# EAGLE design Shutter Sensors Old (EAGLE 9.0.1)
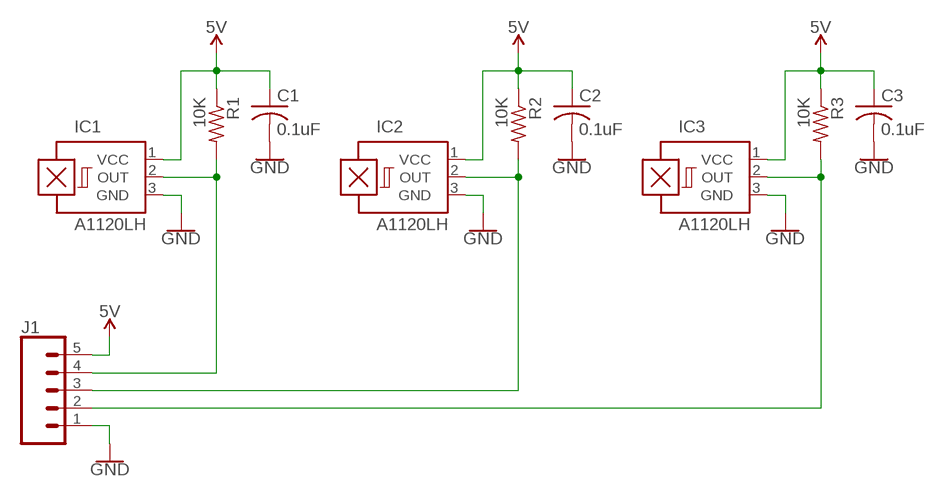
[diagram p0: schematic, sheet 1]

## Parts
C1  0.1uF  C-USC0805  [C0805]
C2  0.1uF  C-USC0805  [C0805]
C3  0.1uF  C-USC0805  [C0805]
IC1  A1120LH  A1203LH  [SOT23-W]
IC2  A1120LH  A1203LH  [SOT23-W]
IC3  A1120LH  A1203LH  [SOT23-W]
J1  CONN_05  [1X05]
R1  10K  R-US_R0805  [R0805]
R2  10K  R-US_R0805  [R0805]
R3  10K  R-US_R0805  [R0805]

## Nets
5V: C1.1 C2.1 C3.1 IC1.1(VCC) IC2.1(VCC) IC3.1(VCC) J1.5 R1.1 R2.1 R3.1
GND: C1.2 C2.2 C3.2 IC1.3(GND) IC2.3(GND) IC3.3(GND) J1.1
N$1: IC1.2(OUT) J1.4 R1.2
N$2: IC3.2(OUT) J1.2 R3.2
N$6: IC2.2(OUT) J1.3 R2.2

## Library data of the parts
C1-C3 = rcl:C-US: CAPACITOR, American symbol; SPICEPREFIX: C
IC1-IC3 = allegro:A12*?: Hall-effect bipolar switch Source: http://www.allegromicro.com/en/Products/Part_Numbers/1202/1202.pdf; MF: ALLEGRO MICROSYSTEMS, INC.; MPN: A1203LLHLT-T; OC_FARNELL: 1791384; OC_NEWARK: 31K6608
J1 = SparkFun-Connectors:CONN_05: Multi connection point. Often used as Generic Header-pin footprint for 0.1 inch spaced/style header connections On any of the 0.1 inch spaced packages, you can populate with these: Break Away Headers - Straight <https://www.sparkfun.com/products/116> (PRT-00116) Break Away Male Headers - Right Angle <https://www.sparkfun.com/products/553> (PRT-00553) Female Headers <https://www.sparkfun.com/products/115> (PRT-00115) Break Away Headers - Machine Pin <https://www.sparkfun.com/products/117> (PRT-00117) Break Away Female Headers - Swiss Machine Pin <https://www.sparkfun.com/products/743> (PRT-00743) For SCREWTERMINALS and SPRING TERMINALS visit here: Screw Terimnals on SparkFun.com <https://www.sparkfun.com/search/results?term=Screw+Terminals> (5mm/3.5mm/2.54mm spacing) This device is also useful as a general connection point to wire up your design to another part of your project. Our various solder wires solder well into these plated through hole pads. Hook-Up Wire - Assortment (Stranded, 22 AWG) <https://www.sparkfun.com/products/11375> (PRT-11375) Hook-Up Wire - Assortment (Solid Core, 22 AWG) <https://www.sparkfun.com/products/11367> (PRT-11367) View the entire wire category on our website here <https://www.sparkfun.com/categories/141> Special notes: Molex polarized connector foot print use with SKU : PRT-08231 with associated crimp pins and housings. 1MM SMD Version SKU: PRT-10208
R1-R3 = rcl:R-US_: RESISTOR, American symbol; SPICEPREFIX: R

## Board
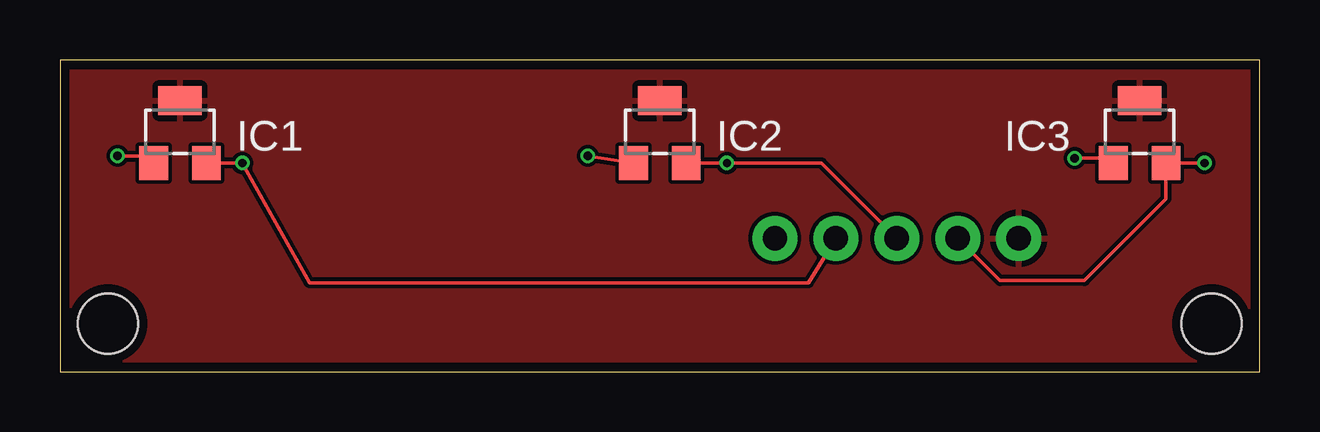
[diagram p1: board, top side]
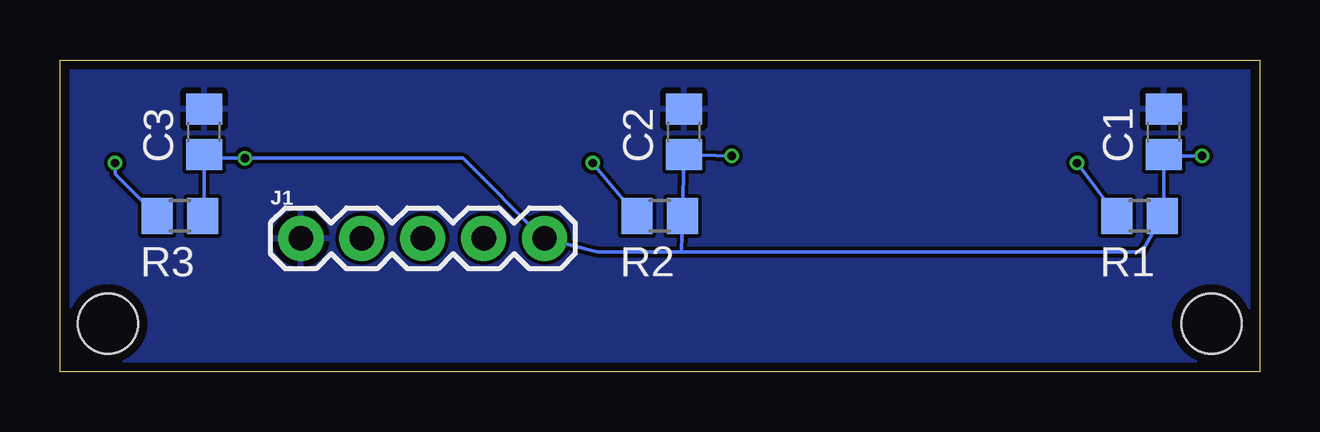
[diagram p2: board, bottom side, seen from below]

Size 50 x 13 mm. Coordinates in mm from the lower left corner, seen from the top.
Outline: 0,0 50,0 50,13 0,13 0,0
Copper layers (1*16): Top 0.035559375mm / dielectric 1.6mm / Bottom 0.035559375mm
Design rules "oshpark-2layer": minimum track width 6mil, minimum drill 10mil, track to track 6mil, track to pad 6mil, pad to pad 6mil, via to via 6mil, smd to smd 6mil, copper to edge 15mil, drill to drill 6mil, minimum pad ring 5mil, minimum via ring 5mil, stop-mask expansion 2.5mil, vias tented up to drill 0mil, thermal gap 10mil
Holes 2.5 mm at 2,2 48,2

### Footprints (pad centres in the part's own frame; a part is rotated, then mirrored left to right if it is on the bottom)
C0805 = smd 1.3 x 1.5: 1 -0.95,0; 2 0.95,0
SOT23-W = smd 1.2 x 1.4: 1 -1.1,-1.3; 2 1.1,-1.3 | smd 1.8 x 1.2: 3 0,1.3
1X05 = drill 1.016 pad 1.88: 1 0,0; 2 2.54,0; 3 5.08,0; 4 7.62,0; 5 10.16,0
R0805 = smd 1.3 x 1.5: 1 -0.95,0; 2 0.95,0

### Placement (x,y rotation side)
C1  4,10 90 bottom
C2  24,10 90 bottom
C3  44,10 90 bottom
IC1  5,10 0 top
IC2  25,10 0 top
IC3  45,10 0 top
J1  39.96,5.56 0 bottom
R1  5,6.5 180 bottom
R2  25,6.5 180 bottom
R3  45,6.5 180 bottom

### Tracks (layer width: path | path; a pad name or v marks a point on that pad's centre or on a via)
5V  (via drill 0.35)
  Top 0.152: v22,9 IC2.1 | v42.3,8.9 43.7,8.9 IC3.1 | v2.4,9 3.6,9 IC1.1
  Bottom 0.152: 24.1,5 27.6,5 J1.5 29.86,5.56 33.2,8.9 v42.3,8.9 43.85,8.9 C3.1 44,6.55 R3.1 | 24.1,5 4.9,5 R1.1 4,6.55 C1.1 3.95,9 v2.4,9 | 24.1,5 R2.1 C2.1 v22,9
GND
  pour Top: 0,0 0,13 50,13 50,0
  pour Bottom: 0,0 0,13 50,13 50,0
N$1  (via drill 0.35)
  Top 0.152: IC1.2 v7.6,8.7 10.4,3.7 31.2,3.7 J1.4
  Bottom 0.152: R1.2 v7.6,8.7
N$2  (via drill 0.35)
  Top 0.152: v47.7,8.7 IC3.2 46.1,7.2 42.7,3.8 39.18,3.8 J1.2
  Bottom 0.152: v47.7,8.7 47.7,8.25 R3.2
N$6  (via drill 0.35)
  Top 0.152: IC2.2 v27.8,8.7 31.74,8.7 J1.3
  Bottom 0.152: R2.2 v27.8,8.7